# Altium project projet_pcb_wordclock.PrjPCB
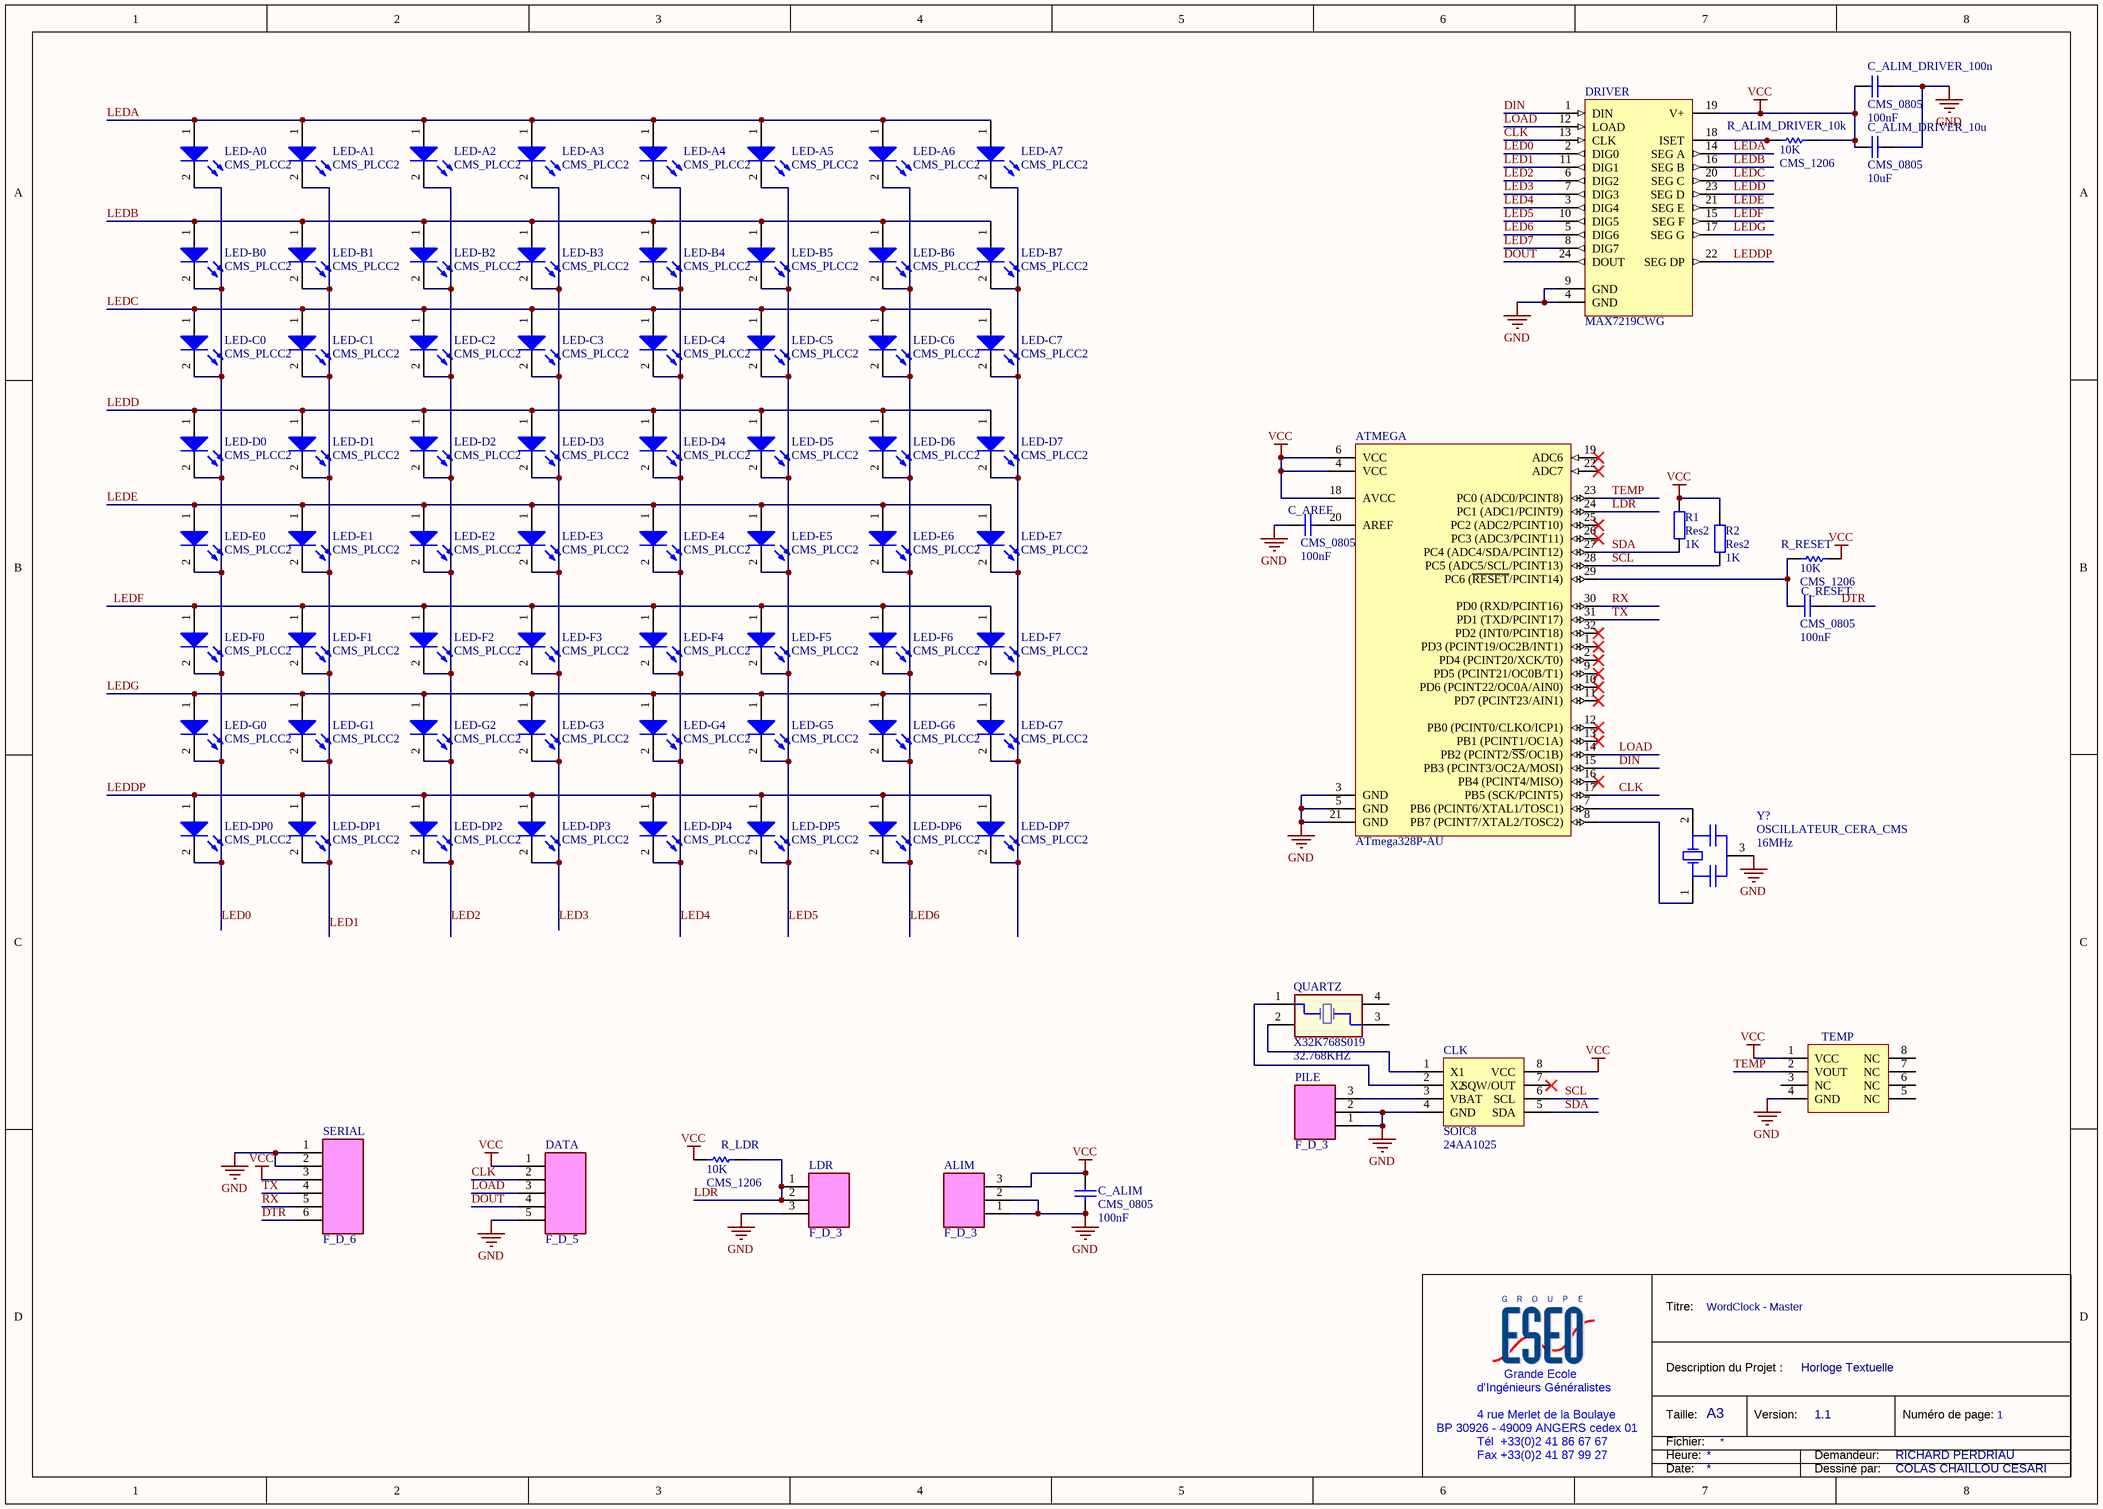
[diagram p0: projet_pcb_wordclock.SchDoc]
1 sheet, 85 parts. Net scope: global (net labels, ports and power ports of the same name join across sheets).
Board files: bas_droite.PcbDoc, bas_gauche.PcbDoc, haut_droite.PcbDoc, projet_pcb_wordclock.PCBDOC

## Sheet projet_pcb_wordclock.SchDoc
size A3

### Parts
ALIM  Type: F_D_3  [BARRETTE_3_F_D]  (hidden comment: BARRETTE 3 CONTACTS 1 RANGEE FEMELLE DROITE)
ATMEGA  ATmega328P-AU  [32A_N]
C_ALIM  value 100nF  [CONDENSATEUR_CMS_0805]  (hidden comment: CMS_0805)
C_ALIM_DRIVER_10u  value 10uF  [CONDENSATEUR_CMS_0805]  (hidden comment: CMS_0805)
C_ALIM_DRIVER_100n  value 100nF  [CONDENSATEUR_CMS_0805]  (hidden comment: CMS_0805)
C_AREF  value 100nF  [CONDENSATEUR_CMS_0805]  (hidden comment: CMS_0805)
C_RESET  value 100nF  [CONDENSATEUR_CMS_0805]  (hidden comment: CMS_0805)
CLK  Package: SOIC8  Type: 24AA1025  [SOIC8_PAS=1.27_LARG=4_LONG=5]  (hidden comment: 24AA1025_SOIC8)
DATA  Type: F_D_5  [BARRETTE_5_F_D]  (hidden comment: BARRETTE_5 CONTACTS_1 RANGEE_FEMELLE_DROITE)
DRIVER  MAX7219CWG  [WSO24_N]
LDR  Type: F_D_3  [BARRETTE_3_F_D]  (hidden comment: BARRETTE 3 CONTACTS 1 RANGEE FEMELLE DROITE)
LED-A0  Type: CMS_PLCC2  [LED_CMS_PLCC2]  (hidden comment: LED_CMS_PLCC2)
LED-A1  Type: CMS_PLCC2  [LED_CMS_PLCC2]  (hidden comment: LED_CMS_PLCC2)
LED-A2  Type: CMS_PLCC2  [LED_CMS_PLCC2]  (hidden comment: LED_CMS_PLCC2)
LED-A3  Type: CMS_PLCC2  [LED_CMS_PLCC2]  (hidden comment: LED_CMS_PLCC2)
LED-A4  Type: CMS_PLCC2  [LED_CMS_PLCC2]  (hidden comment: LED_CMS_PLCC2)
LED-A5  Type: CMS_PLCC2  [LED_CMS_PLCC2]  (hidden comment: LED_CMS_PLCC2)
LED-A6  Type: CMS_PLCC2  [LED_CMS_PLCC2]  (hidden comment: LED_CMS_PLCC2)
LED-A7  Type: CMS_PLCC2  [LED_CMS_PLCC2]  (hidden comment: LED_CMS_PLCC2)
LED-B0  Type: CMS_PLCC2  [LED_CMS_PLCC2]  (hidden comment: LED_CMS_PLCC2)
LED-B1  Type: CMS_PLCC2  [LED_CMS_PLCC2]  (hidden comment: LED_CMS_PLCC2)
LED-B2  Type: CMS_PLCC2  [LED_CMS_PLCC2]  (hidden comment: LED_CMS_PLCC2)
LED-B3  Type: CMS_PLCC2  [LED_CMS_PLCC2]  (hidden comment: LED_CMS_PLCC2)
LED-B4  Type: CMS_PLCC2  [LED_CMS_PLCC2]  (hidden comment: LED_CMS_PLCC2)
LED-B5  Type: CMS_PLCC2  [LED_CMS_PLCC2]  (hidden comment: LED_CMS_PLCC2)
LED-B6  Type: CMS_PLCC2  [LED_CMS_PLCC2]  (hidden comment: LED_CMS_PLCC2)
LED-B7  Type: CMS_PLCC2  [LED_CMS_PLCC2]  (hidden comment: LED_CMS_PLCC2)
LED-C0  Type: CMS_PLCC2  [LED_CMS_PLCC2]  (hidden comment: LED_CMS_PLCC2)
LED-C1  Type: CMS_PLCC2  [LED_CMS_PLCC2]  (hidden comment: LED_CMS_PLCC2)
LED-C2  Type: CMS_PLCC2  [LED_CMS_PLCC2]  (hidden comment: LED_CMS_PLCC2)
LED-C3  Type: CMS_PLCC2  [LED_CMS_PLCC2]  (hidden comment: LED_CMS_PLCC2)
LED-C4  Type: CMS_PLCC2  [LED_CMS_PLCC2]  (hidden comment: LED_CMS_PLCC2)
LED-C5  Type: CMS_PLCC2  [LED_CMS_PLCC2]  (hidden comment: LED_CMS_PLCC2)
LED-C6  Type: CMS_PLCC2  [LED_CMS_PLCC2]  (hidden comment: LED_CMS_PLCC2)
LED-C7  Type: CMS_PLCC2  [LED_CMS_PLCC2]  (hidden comment: LED_CMS_PLCC2)
LED-D0  Type: CMS_PLCC2  [LED_CMS_PLCC2]  (hidden comment: LED_CMS_PLCC2)
LED-D1  Type: CMS_PLCC2  [LED_CMS_PLCC2]  (hidden comment: LED_CMS_PLCC2)
LED-D2  Type: CMS_PLCC2  [LED_CMS_PLCC2]  (hidden comment: LED_CMS_PLCC2)
LED-D3  Type: CMS_PLCC2  [LED_CMS_PLCC2]  (hidden comment: LED_CMS_PLCC2)
LED-D4  Type: CMS_PLCC2  [LED_CMS_PLCC2]  (hidden comment: LED_CMS_PLCC2)
LED-D5  Type: CMS_PLCC2  [LED_CMS_PLCC2]  (hidden comment: LED_CMS_PLCC2)
LED-D6  Type: CMS_PLCC2  [LED_CMS_PLCC2]  (hidden comment: LED_CMS_PLCC2)
LED-D7  Type: CMS_PLCC2  [LED_CMS_PLCC2]  (hidden comment: LED_CMS_PLCC2)
LED-DP0  Type: CMS_PLCC2  [LED_CMS_PLCC2]  (hidden comment: LED_CMS_PLCC2)
LED-DP1  Type: CMS_PLCC2  [LED_CMS_PLCC2]  (hidden comment: LED_CMS_PLCC2)
LED-DP2  Type: CMS_PLCC2  [LED_CMS_PLCC2]  (hidden comment: LED_CMS_PLCC2)
LED-DP3  Type: CMS_PLCC2  [LED_CMS_PLCC2]  (hidden comment: LED_CMS_PLCC2)
LED-DP4  Type: CMS_PLCC2  [LED_CMS_PLCC2]  (hidden comment: LED_CMS_PLCC2)
LED-DP5  Type: CMS_PLCC2  [LED_CMS_PLCC2]  (hidden comment: LED_CMS_PLCC2)
LED-DP6  Type: CMS_PLCC2  [LED_CMS_PLCC2]  (hidden comment: LED_CMS_PLCC2)
LED-DP7  Type: CMS_PLCC2  [LED_CMS_PLCC2]  (hidden comment: LED_CMS_PLCC2)
LED-E0  Type: CMS_PLCC2  [LED_CMS_PLCC2]  (hidden comment: LED_CMS_PLCC2)
LED-E1  Type: CMS_PLCC2  [LED_CMS_PLCC2]  (hidden comment: LED_CMS_PLCC2)
LED-E2  Type: CMS_PLCC2  [LED_CMS_PLCC2]  (hidden comment: LED_CMS_PLCC2)
LED-E3  Type: CMS_PLCC2  [LED_CMS_PLCC2]  (hidden comment: LED_CMS_PLCC2)
LED-E4  Type: CMS_PLCC2  [LED_CMS_PLCC2]  (hidden comment: LED_CMS_PLCC2)
LED-E5  Type: CMS_PLCC2  [LED_CMS_PLCC2]  (hidden comment: LED_CMS_PLCC2)
LED-E6  Type: CMS_PLCC2  [LED_CMS_PLCC2]  (hidden comment: LED_CMS_PLCC2)
LED-E7  Type: CMS_PLCC2  [LED_CMS_PLCC2]  (hidden comment: LED_CMS_PLCC2)
LED-F0  Type: CMS_PLCC2  [LED_CMS_PLCC2]  (hidden comment: LED_CMS_PLCC2)
LED-F1  Type: CMS_PLCC2  [LED_CMS_PLCC2]  (hidden comment: LED_CMS_PLCC2)
LED-F2  Type: CMS_PLCC2  [LED_CMS_PLCC2]  (hidden comment: LED_CMS_PLCC2)
LED-F3  Type: CMS_PLCC2  [LED_CMS_PLCC2]  (hidden comment: LED_CMS_PLCC2)
LED-F4  Type: CMS_PLCC2  [LED_CMS_PLCC2]  (hidden comment: LED_CMS_PLCC2)
LED-F5  Type: CMS_PLCC2  [LED_CMS_PLCC2]  (hidden comment: LED_CMS_PLCC2)
LED-F6  Type: CMS_PLCC2  [LED_CMS_PLCC2]  (hidden comment: LED_CMS_PLCC2)
LED-F7  Type: CMS_PLCC2  [LED_CMS_PLCC2]  (hidden comment: LED_CMS_PLCC2)
LED-G0  Type: CMS_PLCC2  [LED_CMS_PLCC2]  (hidden comment: LED_CMS_PLCC2)
LED-G1  Type: CMS_PLCC2  [LED_CMS_PLCC2]  (hidden comment: LED_CMS_PLCC2)
LED-G2  Type: CMS_PLCC2  [LED_CMS_PLCC2]  (hidden comment: LED_CMS_PLCC2)
LED-G3  Type: CMS_PLCC2  [LED_CMS_PLCC2]  (hidden comment: LED_CMS_PLCC2)
LED-G4  Type: CMS_PLCC2  [LED_CMS_PLCC2]  (hidden comment: LED_CMS_PLCC2)
LED-G5  Type: CMS_PLCC2  [LED_CMS_PLCC2]  (hidden comment: LED_CMS_PLCC2)
LED-G6  Type: CMS_PLCC2  [LED_CMS_PLCC2]  (hidden comment: LED_CMS_PLCC2)
LED-G7  Type: CMS_PLCC2  [LED_CMS_PLCC2]  (hidden comment: LED_CMS_PLCC2)
PILE  Type: F_D_3  [BARRETTE_3_F_D]  (hidden comment: BARRETTE 3 CONTACTS 1 RANGEE FEMELLE DROITE)
QUARTZ  value 32.768KHZ  Type: X32K768S019  [QUARTZ_CMS_FA238_4PLOTS - duplicate]  (hidden comment: QUARTZ 32.768KHZ, 12.5PF, 7 X 1.5MM)
R1  Res2  value 1K  [AXIAL-0.4]
R2  Res2  value 1K  [AXIAL-0.4]
R_ALIM_DRIVER_10k  value 10K  Type: CMS_1206  [RESISTANCE_CMS_1206]  (hidden comment: RESISTANCE_CMS_1206)
R_LDR  value 10K  Type: CMS_1206  [RESISTANCE_CMS_1206]  (hidden comment: RESISTANCE_CMS_1206)
R_RESET  value 10K  Type: CMS_1206  [RESISTANCE_CMS_1206]  (hidden comment: RESISTANCE_CMS_1206)
SERIAL  Type: F_D_6  [BARRETTE_6_F_D]  (hidden comment: BARRETTE_6 CONTACTS_1 RANGEE_FEMELLE_DROITE)
TEMP  Package: SOIC8  Type: 24AA1025  [SOIC8_PAS=1.27_LARG=4_LONG=5]  (hidden comment: 24AA1025_SOIC8)
Y?  value 16MHz  [OSCILLATEUR_CERA_CMS]  (hidden comment: OSCILLATEUR_CERA_CMS)

### Nets
GND: ALIM.1 ALIM.2 ATMEGA.3(GND) ATMEGA.5(GND) ATMEGA.21(GND) C_ALIM.1 C_ALIM_DRIVER_10u.1 C_ALIM_DRIVER_100n.1 C_AREF.1 CLK.4(GND) DATA.5 DRIVER.4(GND) DRIVER.9(GND) LDR.3 PILE.1 PILE.2 SERIAL.1 SERIAL.2 TEMP.4(GND) Y?.3
VCC: ALIM.3 ATMEGA.4(VCC) ATMEGA.6(VCC) ATMEGA.18(AVCC) C_ALIM.2 C_ALIM_DRIVER_10u.2 C_ALIM_DRIVER_100n.2 CLK.8(VCC) DATA.1 DRIVER.19(V+) R1.2 R2.2 R_ALIM_DRIVER_10k.1 R_LDR.2 R_RESET.1 SERIAL.3 TEMP.1(VCC)
CLK: ATMEGA.17(PB5_(SCK/PCINT5)) DATA.2 DRIVER.13(CLK)
DIN: ATMEGA.15(PB3_(PCINT3/OC2A/MOSI)) DRIVER.1(DIN)
DOUT: DATA.4 DRIVER.24(DOUT)
DTR: C_RESET.2 SERIAL.6
LDR: ATMEGA.24(PC1_(ADC1/PCINT9)) LDR.1 LDR.2 R_LDR.1
LED0: DRIVER.2(DIG0) LED-A0.2 LED-B0.2 LED-C0.2 LED-D0.2 LED-DP0.2 LED-E0.2 LED-F0.2 LED-G0.2
LED1: DRIVER.11(DIG1) LED-A1.2 LED-B1.2 LED-C1.2 LED-D1.2 LED-DP1.2 LED-E1.2 LED-F1.2 LED-G1.2
LED2: DRIVER.6(DIG2) LED-A2.2 LED-B2.2 LED-C2.2 LED-D2.2 LED-DP2.2 LED-E2.2 LED-F2.2 LED-G2.2
LED3: DRIVER.7(DIG3) LED-A3.2 LED-B3.2 LED-C3.2 LED-D3.2 LED-DP3.2 LED-E3.2 LED-F3.2 LED-G3.2
LED4: DRIVER.3(DIG4) LED-A4.2 LED-B4.2 LED-C4.2 LED-D4.2 LED-DP4.2 LED-E4.2 LED-F4.2 LED-G4.2
LED5: DRIVER.10(DIG5) LED-A5.2 LED-B5.2 LED-C5.2 LED-D5.2 LED-DP5.2 LED-E5.2 LED-F5.2 LED-G5.2
LED6: DRIVER.5(DIG6) LED-A6.2 LED-B6.2 LED-C6.2 LED-D6.2 LED-DP6.2 LED-E6.2 LED-F6.2 LED-G6.2
LED7: DRIVER.8(DIG7)
LEDA: DRIVER.14(SEG_A) LED-A0.1 LED-A1.1 LED-A2.1 LED-A3.1 LED-A4.1 LED-A5.1 LED-A6.1 LED-A7.1
LEDB: DRIVER.16(SEG_B) LED-B0.1 LED-B1.1 LED-B2.1 LED-B3.1 LED-B4.1 LED-B5.1 LED-B6.1 LED-B7.1
LEDC: DRIVER.20(SEG_C) LED-C0.1 LED-C1.1 LED-C2.1 LED-C3.1 LED-C4.1 LED-C5.1 LED-C6.1 LED-C7.1
LEDD: DRIVER.23(SEG_D) LED-D0.1 LED-D1.1 LED-D2.1 LED-D3.1 LED-D4.1 LED-D5.1 LED-D6.1 LED-D7.1
LEDDP: DRIVER.22(SEG_DP) LED-DP0.1 LED-DP1.1 LED-DP2.1 LED-DP3.1 LED-DP4.1 LED-DP5.1 LED-DP6.1 LED-DP7.1
LEDE: DRIVER.21(SEG_E) LED-E0.1 LED-E1.1 LED-E2.1 LED-E3.1 LED-E4.1 LED-E5.1 LED-E6.1 LED-E7.1
LEDF: DRIVER.15(SEG_F) LED-F0.1 LED-F1.1 LED-F2.1 LED-F3.1 LED-F4.1 LED-F5.1 LED-F6.1 LED-F7.1
LEDG: DRIVER.17(SEG_G) LED-G0.1 LED-G1.1 LED-G2.1 LED-G3.1 LED-G4.1 LED-G5.1 LED-G6.1 LED-G7.1
LOAD: ATMEGA.14(PB2_(PCINT2/~{SS}/OC1B)) DATA.3 DRIVER.12(LOAD)
RX: ATMEGA.30(PD0_(RXD/PCINT16)) SERIAL.5
SCL: ATMEGA.28(PC5_(ADC5/SCL/PCINT13)) CLK.6(SCL) R2.1
SDA: ATMEGA.27(PC4_(ADC4/SDA/PCINT12)) CLK.5(SDA) R1.1
TEMP: ATMEGA.23(PC0_(ADC0/PCINT8)) TEMP.2(VOUT)
TX: ATMEGA.31(PD1_(TXD/PCINT17)) SERIAL.4
NetATMEGA_7: ATMEGA.7(PB6_(PCINT6/XTAL1/TOSC1)) Y?.2
NetATMEGA_8: ATMEGA.8(PB7_(PCINT7/XTAL2/TOSC2)) Y?.1
NetATMEGA_20: ATMEGA.20(AREF) C_AREF.2
NetATMEGA_29: ATMEGA.29(PC6_(~{RESET}/PCINT14)) C_RESET.1 R_RESET.2
NetCLK_1: CLK.1(X1) QUARTZ.2(GND)
NetCLK_2: CLK.2(X2) QUARTZ.1(OSC1)
NetCLK_3: CLK.3(VBAT) PILE.3
NetDRIVER_18: DRIVER.18(ISET) R_ALIM_DRIVER_10k.2
NetLED-A7_2: LED-A7.2 LED-B7.2 LED-C7.2 LED-D7.2 LED-DP7.2 LED-E7.2 LED-F7.2 LED-G7.2

Not connected (* = marked no-connect by the designer): ATMEGA 1(PD3_(PCINT19/OC2B/INT1))* 2(PD4_(PCINT20/XCK/T0))* 9(PD5_(PCINT21/OC0B/T1))* 10(PD6_(PCINT22/OC0A/AIN0))* 11(PD7_(PCINT23/AIN1))* 12(PB0_(PCINT0/CLKO/ICP1))* 13(PB1_(PCINT1/OC1A))* 16(PB4_(PCINT4/MISO))* 19(ADC6)* 22(ADC7)* 25(PC2_(ADC2/PCINT10))* 26(PC3_(ADC3/PCINT11))* 32(PD2_(INT0/PCINT18))*; CLK 7(SQW/OUT)*; QUARTZ 3(OSC2) 4(GND); TEMP 3(NC) 5(NC) 6(NC) 7(NC) 8(NC)

### Notes on the sheet
- Titre:
- WordClock - Master
- d'Ingénieurs Généralistes
- Grande Ecole
- Description du Projet :
- Horloge Textuelle
- BP 30926 - 49009 ANGERS cedex 01
- 4 rue Merlet de la Boulaye
- Tél  +33(0)2 41 86 67 67
- Fax +33(0)2 41 87 99 27
- Taille:
- Heure:
- Fichier:
- A3
- Version:
- 1.1
- Demandeur:
- RICHARD PERDRIAU
- Numéro de page:
- 1
- Date:
- Dessiné par:
- COLAS CHAILLOU CESARI

### Library data of the parts
ALIM LDR PILE = BARRETTE_3 CONTACTS_1 RANGEE_FEMELLE_DROITE
ATMEGA = ATmega328P-AU: 8-bit AVR Microcontroller, 32KB Flash, 1KB EEPROM, 2KB SRAM, 32-pin TQFP, Industrial Grade (-40°C to 85°C); Published: 1-Apr-2010; DatasheetVersion: revA, Jan-2010; PackageVersion: revB, Oct-2001; PackageReference: 32A; Publisher: Altium Limited; PackageDescription: 32-Lead, 7x7x1.0 mm Body, 0.8mm Lead Pitch, Thin Profile Plastic Quad Flat Package (TQFP); Supplier 1: Digi-Key; Supplier Part Number 1: ATMEGA328P-AU-ND; Supplier 2: Farnell; Supplier Part Number 2: 1715486; Supplier 3: Mouser; Supplier Part Number 3: 556-ATMEGA328P-AU; Code_JEDEC: MS-026-ABA; ComponentLink1Description: Manufacturer Link; ComponentLink1URL: http://www.atmel.com/products/avr/default.asp?; ComponentLink2Description: ATmega48A/48PA/88A/88PA/168A/168PA/328/328P Datasheet; ComponentLink2URL: http://www.atmel.com/dyn/resources/prod_documents/8271.pdf; ComponentLink3Description: ATmega48A/48PA/88A/88PA/168A/168PA/328/328P Summary; ComponentLink3URL: http://www.atmel.com/dyn/resources/prod_documents/8271S.pdf; ComponentLink4Description: Atmel.com Home; ComponentLink4URL: http://www.atmel.com
C_ALIM C_ALIM_DRIVER_10u C_ALIM_DRIVER_100n C_AREF C_RESET = CONDENSATEUR_CMS_CER_0805: CONDENSATEUR CMS CERAMIQUE 0805; Type: CMS_0805
CLK TEMP = 24AA1025_SOIC8: MEMOIRE EEPROM SERIE 1024k - SOIC8
DATA = BARRETTE_5 CONTACTS_1 RANGEE_FEMELLE_DROITE: BARRETTE 5 CONTACTS 1 RANGEE FEMELLE DROITE
DRIVER = MAX7219CWG: Serially Interfaced, 8-Digit LED Display Driver; Published: 16-Jan-2001; LatestRevisionDate: 13-Apr-2006; LatestRevisionNote: IPC-7351 Footprint Added.; DatasheetVersion: Jul-1997; PackageReference: WSO24; Publisher: Altium Limited; PackageDescription: 24-Pin Small Outline Integrated Circuit 1.27 mm Pitch; ComponentLink1Description: Manufacturer Link; ComponentLink1URL: http://www.maxim-ic.com/; ComponentLink2Description: Datasheet; ComponentLink2URL: http://pdfserv.maxim-ic.com/en/ds/MAX7219-MAX7221.pdf
LED-A0-LED-A7 LED-B0-LED-B7 LED-C0-LED-C7 LED-D0-LED-D7 LED-DP0-LED-DP7 LED-E0-LED-E7 LED-F0-LED-F7 LED-G0-LED-G7 = LED_CMS_PLCC2: LED CMS PLCC2
R1 R2 = Res2: Resistor; Published: 8-Jun-2000; LatestRevisionDate: 17-Jul-2002; LatestRevisionNote: Re-released for DXP Platform.; PackageReference: AXIAL-0.4; Publisher: Altium Limited; PackageDescription: Axial Device, Thru-Hole; 2 Leads; 0.4 in Pin Spacing
R_ALIM_DRIVER_10k R_LDR R_RESET = RESISTANCE_CMS_1206: RESISTANCE CMS 1206
SERIAL = BARRETTE_6 CONTACTS_1 RANGEE_FEMELLE_DROITE: BARRETTE 6 CONTACTS 1 RANGEE FEMELLE DROITE
Y? = OSCILLATEUR_CERA_CMS: Type: OSCILLATEUR_CERA_CMS